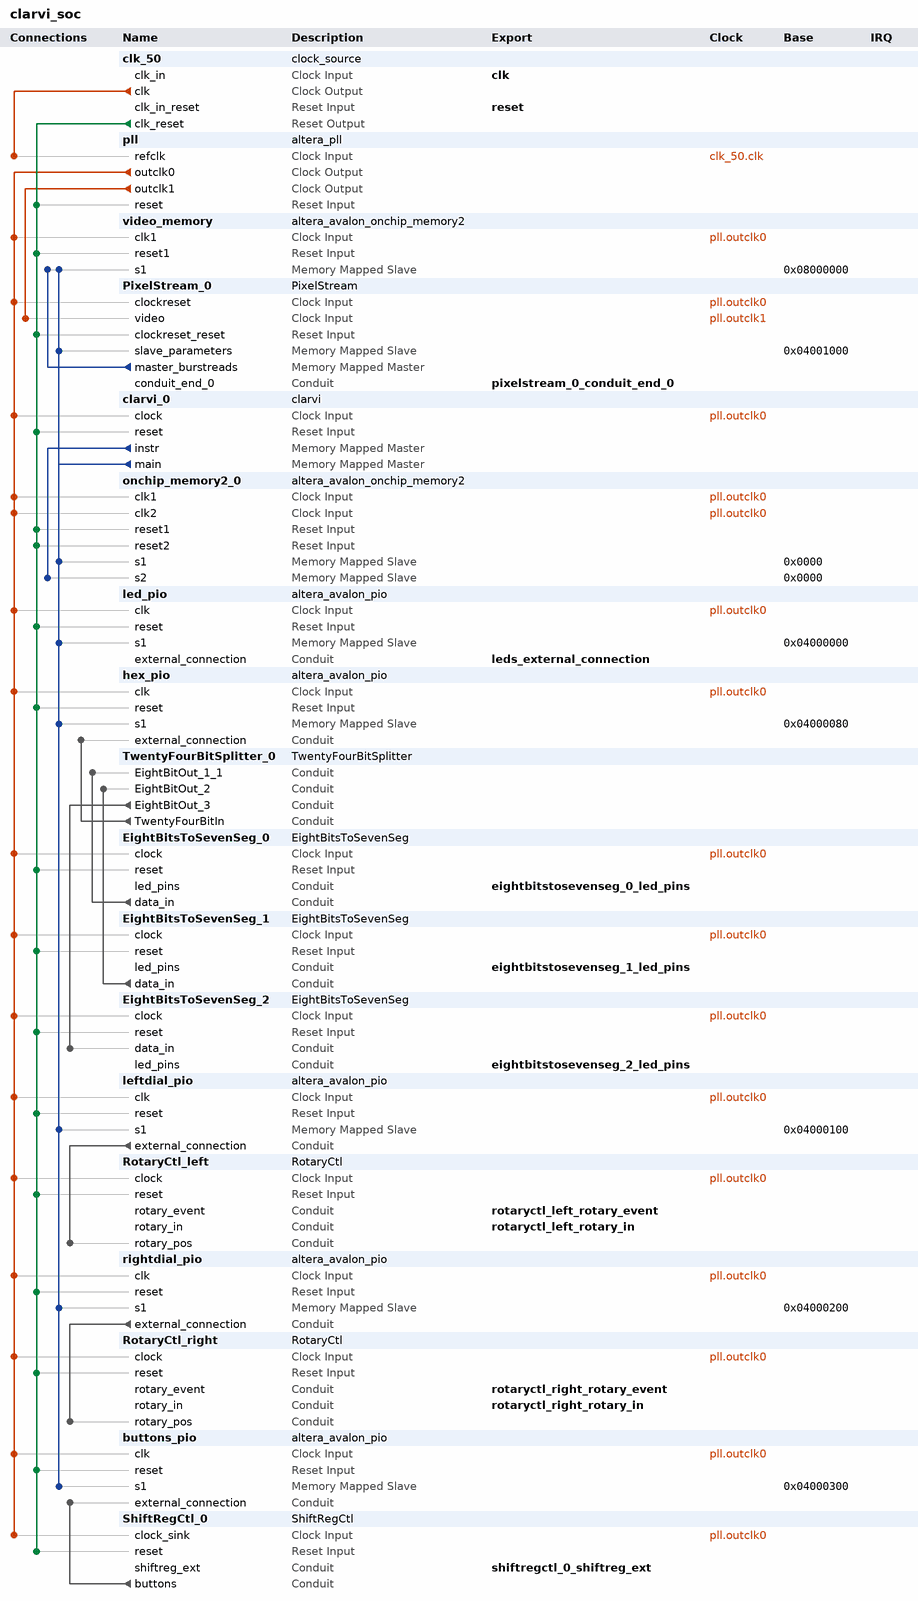
[diagram p0: system contents]
# Platform Designer (Qsys) system clarvi_soc, Cyclone V 5CSEMA5F31C6
# Parameters at their usual value, and those the tool derives, are not listed.
package require -exact qsys 16.1
create_system clarvi_soc
set_project_property DEVICE_FAMILY {Cyclone V}
set_project_property DEVICE 5CSEMA5F31C6

add_instance clk_50 clock_source 16.1
set_instance_parameter_value clk_50 clockFrequency 50000000

add_instance pll altera_pll 16.1
set_instance_parameter_value pll gui_device_speed_grade 2
set_instance_parameter_value pll gui_number_of_clocks 2
set_instance_parameter_value pll gui_operation_mode direct
set_instance_parameter_value pll gui_output_clock_frequency0 50.0
set_instance_parameter_value pll gui_output_clock_frequency1 9.0
set_instance_parameter_value pll gui_pll_mode {Integer-N PLL}
set_instance_parameter_value pll gui_reference_clock_frequency 50.0
set_instance_parameter_value pll gui_use_locked false

add_instance video_memory altera_avalon_onchip_memory2 16.1
set_instance_parameter_value video_memory dataWidth 32
set_instance_parameter_value video_memory dualPort false
set_instance_parameter_value video_memory initMemContent false
set_instance_parameter_value video_memory initializationFileName onchip_mem.hex
set_instance_parameter_value video_memory memorySize 261120

add_instance PixelStream_0 PixelStream 1.0

add_instance clarvi_0 clarvi 1.0
set_instance_parameter_value clarvi_0 DATA_ADDR_WIDTH 29
set_instance_parameter_value clarvi_0 DEFAULT_TRAP_VECTOR 0
set_instance_parameter_value clarvi_0 INITIAL_PC 0
set_instance_parameter_value clarvi_0 INSTR_ADDR_WIDTH 14

add_instance onchip_memory2_0 altera_avalon_onchip_memory2 16.1
set_instance_parameter_value onchip_memory2_0 dataWidth 32
set_instance_parameter_value onchip_memory2_0 dualPort true
set_instance_parameter_value onchip_memory2_0 initMemContent true
set_instance_parameter_value onchip_memory2_0 initializationFileName mem.hex
set_instance_parameter_value onchip_memory2_0 memorySize 65536
set_instance_parameter_value onchip_memory2_0 useNonDefaultInitFile true

add_instance led_pio altera_avalon_pio 16.1
set_instance_parameter_value led_pio direction Output
set_instance_parameter_value led_pio width 10

add_instance hex_pio altera_avalon_pio 16.1
set_instance_parameter_value hex_pio direction Output
set_instance_parameter_value hex_pio width 24

add_instance TwentyFourBitSplitter_0 TwentyFourBitSplitter 1.0

add_instance EightBitsToSevenSeg_0 EightBitsToSevenSeg 1.0

add_instance EightBitsToSevenSeg_1 EightBitsToSevenSeg 1.0

add_instance EightBitsToSevenSeg_2 EightBitsToSevenSeg 1.0

add_instance leftdial_pio altera_avalon_pio 16.1
set_instance_parameter_value leftdial_pio direction Input
set_instance_parameter_value leftdial_pio width 8

add_instance RotaryCtl_left RotaryCtl 1.0

add_instance rightdial_pio altera_avalon_pio 16.1
set_instance_parameter_value rightdial_pio direction Input
set_instance_parameter_value rightdial_pio width 8

add_instance RotaryCtl_right RotaryCtl 1.0

add_instance buttons_pio altera_avalon_pio 16.1
set_instance_parameter_value buttons_pio direction Input
set_instance_parameter_value buttons_pio width 16

add_instance ShiftRegCtl_0 ShiftRegCtl 1.0

# connections
add_connection clk_50.clk pll.refclk clock
add_connection pll.outclk0 buttons_pio.clk clock
add_connection pll.outclk0 clarvi_0.clock clock
add_connection pll.outclk0 EightBitsToSevenSeg_0.clock clock
add_connection pll.outclk0 EightBitsToSevenSeg_1.clock clock
add_connection pll.outclk0 EightBitsToSevenSeg_2.clock clock
add_connection pll.outclk0 hex_pio.clk clock
add_connection pll.outclk0 led_pio.clk clock
add_connection pll.outclk0 leftdial_pio.clk clock
add_connection pll.outclk0 onchip_memory2_0.clk1 clock
add_connection pll.outclk0 onchip_memory2_0.clk2 clock
add_connection pll.outclk0 PixelStream_0.clockreset clock
add_connection pll.outclk0 rightdial_pio.clk clock
add_connection pll.outclk0 RotaryCtl_left.clock clock
add_connection pll.outclk0 RotaryCtl_right.clock clock
add_connection pll.outclk0 ShiftRegCtl_0.clock_sink clock
add_connection pll.outclk0 video_memory.clk1 clock
add_connection pll.outclk1 PixelStream_0.video clock
add_connection clk_50.clk_reset buttons_pio.reset reset
add_connection clk_50.clk_reset clarvi_0.reset reset
add_connection clk_50.clk_reset EightBitsToSevenSeg_0.reset reset
add_connection clk_50.clk_reset EightBitsToSevenSeg_1.reset reset
add_connection clk_50.clk_reset EightBitsToSevenSeg_2.reset reset
add_connection clk_50.clk_reset hex_pio.reset reset
add_connection clk_50.clk_reset led_pio.reset reset
add_connection clk_50.clk_reset leftdial_pio.reset reset
add_connection clk_50.clk_reset onchip_memory2_0.reset1 reset
add_connection clk_50.clk_reset onchip_memory2_0.reset2 reset
add_connection clk_50.clk_reset PixelStream_0.clockreset_reset reset
add_connection clk_50.clk_reset pll.reset reset
add_connection clk_50.clk_reset rightdial_pio.reset reset
add_connection clk_50.clk_reset RotaryCtl_left.reset reset
add_connection clk_50.clk_reset RotaryCtl_right.reset reset
add_connection clk_50.clk_reset ShiftRegCtl_0.reset reset
add_connection clk_50.clk_reset video_memory.reset1 reset
add_connection clarvi_0.instr onchip_memory2_0.s2 avalon
set_connection_parameter_value clarvi_0.instr/onchip_memory2_0.s2 baseAddress 0x0000
add_connection clarvi_0.main buttons_pio.s1 avalon
set_connection_parameter_value clarvi_0.main/buttons_pio.s1 baseAddress 0x04000300
add_connection clarvi_0.main hex_pio.s1 avalon
set_connection_parameter_value clarvi_0.main/hex_pio.s1 baseAddress 0x04000080
add_connection clarvi_0.main led_pio.s1 avalon
set_connection_parameter_value clarvi_0.main/led_pio.s1 baseAddress 0x04000000
add_connection clarvi_0.main leftdial_pio.s1 avalon
set_connection_parameter_value clarvi_0.main/leftdial_pio.s1 baseAddress 0x04000100
add_connection clarvi_0.main onchip_memory2_0.s1 avalon
set_connection_parameter_value clarvi_0.main/onchip_memory2_0.s1 baseAddress 0x0000
add_connection clarvi_0.main PixelStream_0.slave_parameters avalon
set_connection_parameter_value clarvi_0.main/PixelStream_0.slave_parameters baseAddress 0x04001000
add_connection clarvi_0.main rightdial_pio.s1 avalon
set_connection_parameter_value clarvi_0.main/rightdial_pio.s1 baseAddress 0x04000200
add_connection clarvi_0.main video_memory.s1 avalon
set_connection_parameter_value clarvi_0.main/video_memory.s1 baseAddress 0x08000000
add_connection PixelStream_0.master_burstreads video_memory.s1 avalon
set_connection_parameter_value PixelStream_0.master_burstreads/video_memory.s1 baseAddress 0x08000000
add_connection EightBitsToSevenSeg_0.data_in TwentyFourBitSplitter_0.EightBitOut_1_1 conduit
add_connection EightBitsToSevenSeg_1.data_in TwentyFourBitSplitter_0.EightBitOut_2 conduit
add_connection leftdial_pio.external_connection RotaryCtl_left.rotary_pos conduit
add_connection rightdial_pio.external_connection RotaryCtl_right.rotary_pos conduit
add_connection ShiftRegCtl_0.buttons buttons_pio.external_connection conduit
add_connection TwentyFourBitSplitter_0.EightBitOut_3 EightBitsToSevenSeg_2.data_in conduit
add_connection TwentyFourBitSplitter_0.TwentyFourBitIn hex_pio.external_connection conduit

# exported interfaces
add_interface clk clock sink
set_interface_property clk EXPORT_OF clk_50.clk_in
add_interface eightbitstosevenseg_0_led_pins conduit end
set_interface_property eightbitstosevenseg_0_led_pins EXPORT_OF EightBitsToSevenSeg_0.led_pins
add_interface eightbitstosevenseg_1_led_pins conduit end
set_interface_property eightbitstosevenseg_1_led_pins EXPORT_OF EightBitsToSevenSeg_1.led_pins
add_interface eightbitstosevenseg_2_led_pins conduit end
set_interface_property eightbitstosevenseg_2_led_pins EXPORT_OF EightBitsToSevenSeg_2.led_pins
add_interface leds_external_connection conduit end
set_interface_property leds_external_connection EXPORT_OF led_pio.external_connection
add_interface pixelstream_0_conduit_end_0 conduit end
set_interface_property pixelstream_0_conduit_end_0 EXPORT_OF PixelStream_0.conduit_end_0
add_interface reset reset sink
set_interface_property reset EXPORT_OF clk_50.clk_in_reset
add_interface rotaryctl_left_rotary_event conduit end
set_interface_property rotaryctl_left_rotary_event EXPORT_OF RotaryCtl_left.rotary_event
add_interface rotaryctl_left_rotary_in conduit end
set_interface_property rotaryctl_left_rotary_in EXPORT_OF RotaryCtl_left.rotary_in
add_interface rotaryctl_right_rotary_event conduit end
set_interface_property rotaryctl_right_rotary_event EXPORT_OF RotaryCtl_right.rotary_event
add_interface rotaryctl_right_rotary_in conduit end
set_interface_property rotaryctl_right_rotary_in EXPORT_OF RotaryCtl_right.rotary_in
add_interface shiftregctl_0_shiftreg_ext conduit end
set_interface_property shiftregctl_0_shiftreg_ext EXPORT_OF ShiftRegCtl_0.shiftreg_ext

set_interconnect_requirement {$system} qsys_mm.clockCrossingAdapter HANDSHAKE
set_interconnect_requirement {$system} qsys_mm.enableEccProtection FALSE
set_interconnect_requirement {$system} qsys_mm.insertDefaultSlave FALSE
set_interconnect_requirement {$system} qsys_mm.maxAdditionalLatency 1

save_system clarvi_soc.qsys
